# EAGLE schematic bc-module-sensor (EAGLE 7.7.0)
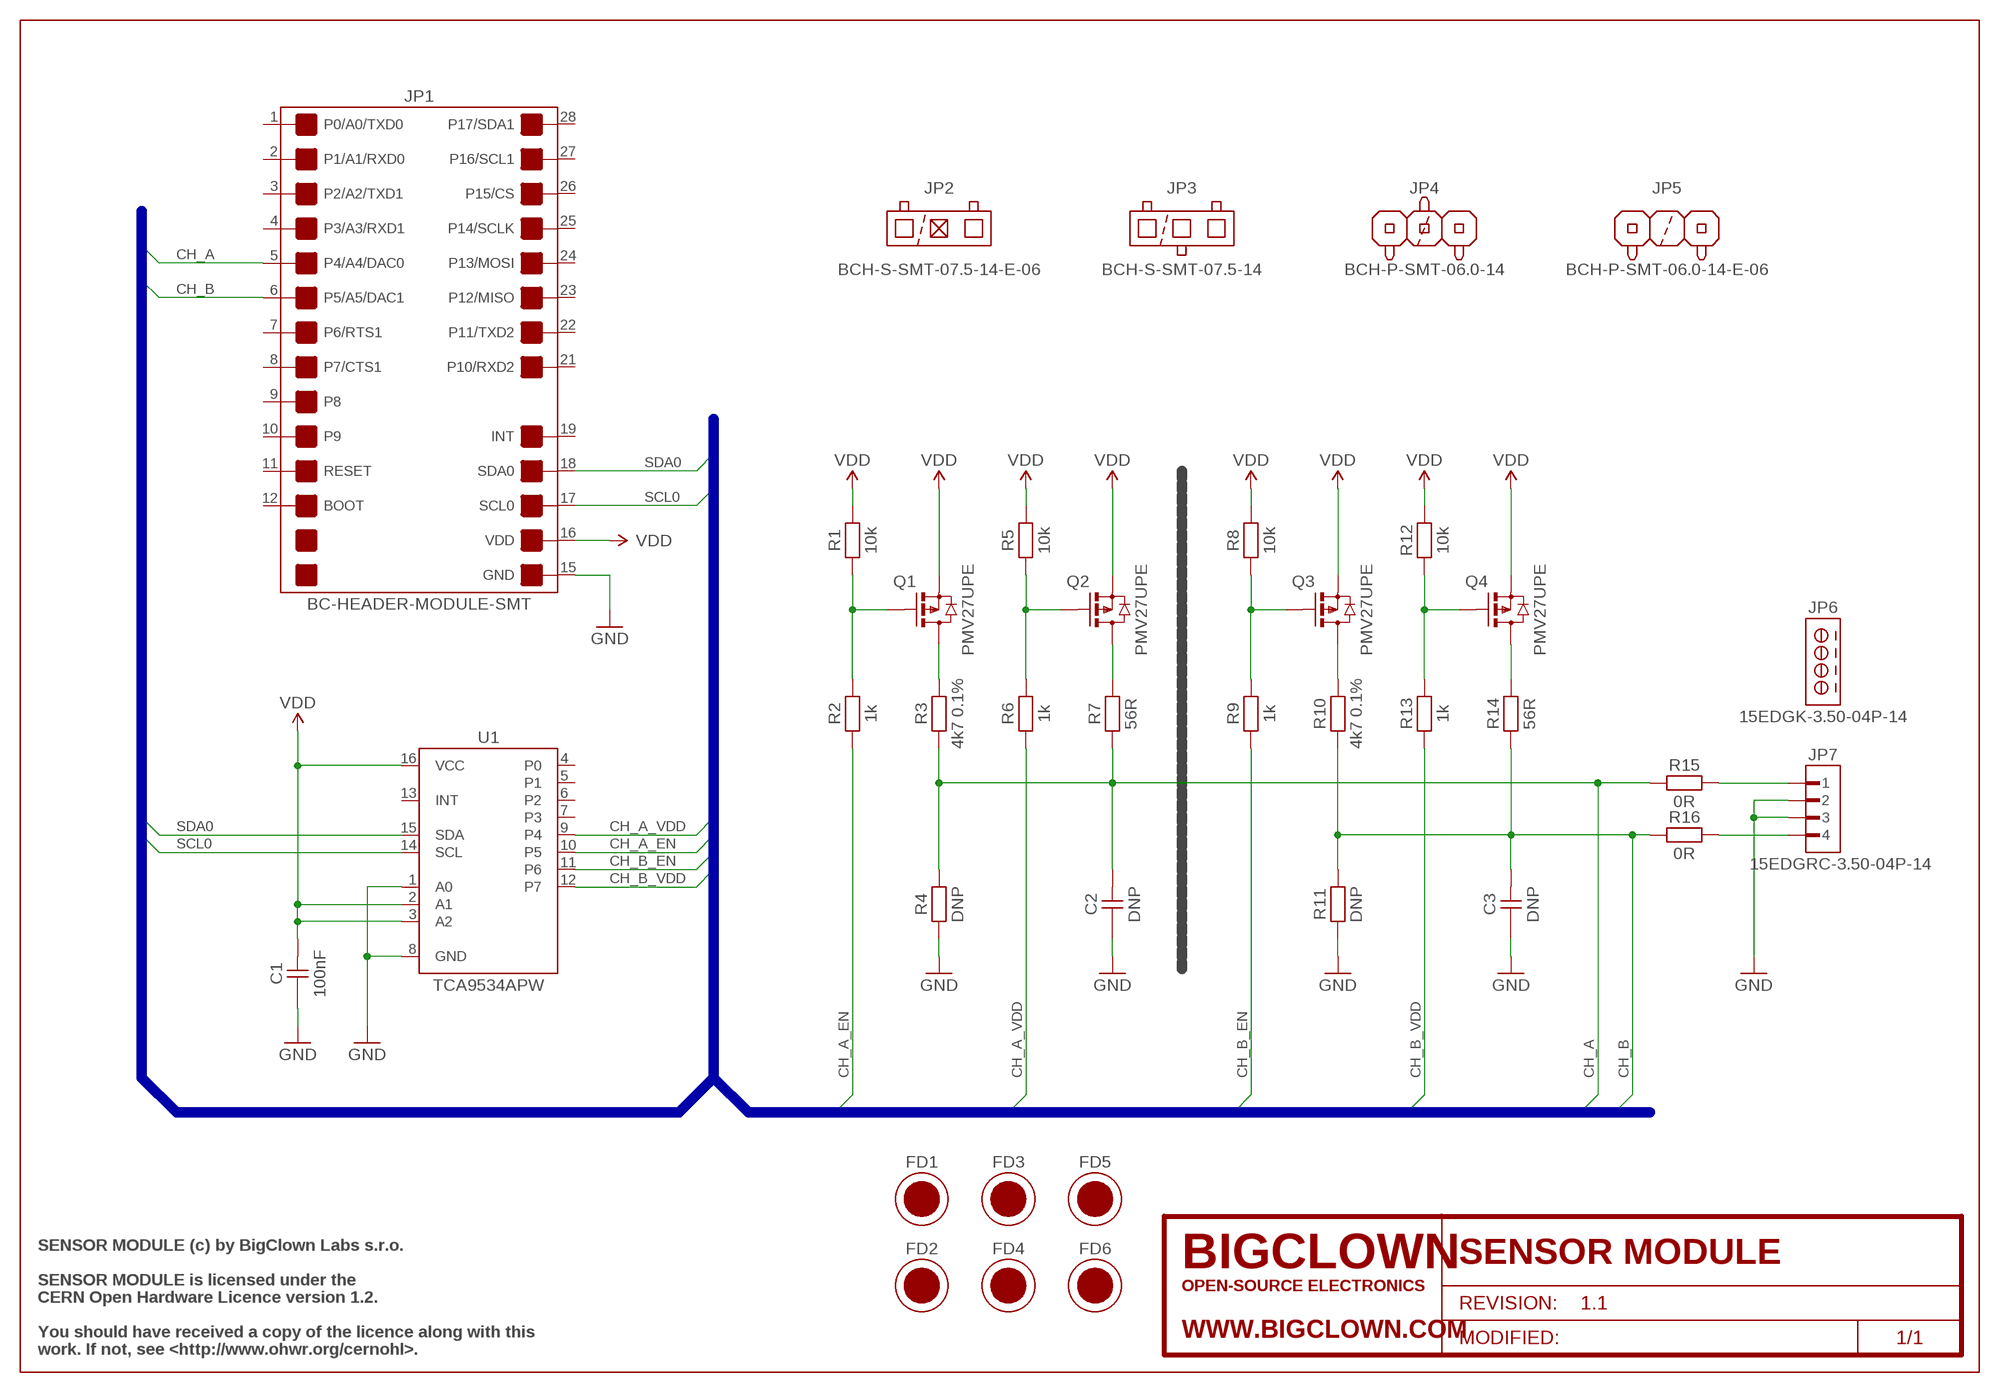
[diagram p0: schematic, sheet 1]
JP6 (JP-15EDGK-3.50-04P-14): BCPN: BC-JP-15EDGK-3.50-04P-14; VALUE: 15EDGK-3.50-04P-14

## Parts
C1  100nF  C-0603-100NF  [CAPACITOR-0603_R]
C2  DNP  C-0805-DNP  [CAPACITOR-0805_R]
C3  DNP  C-0805-DNP  [CAPACITOR-0805_R]
FD1  FIDUCIAL  [FIDUCIAL-1MM]
FD2  FIDUCIAL  [FIDUCIAL-1MM]
FD3  FIDUCIAL  [FIDUCIAL-1MM]
FD4  FIDUCIAL  [FIDUCIAL-1MM]
FD5  FIDUCIAL  [FIDUCIAL-1MM]
FD6  FIDUCIAL  [FIDUCIAL-1MM]
FRAME1  FRAME-SCH/A4L-BRD/A4L  [FRAME-A4L]
JP1  BC-HEADER-MODULE-SMT  [BC-HEADER-MODULE-SMT]
JP2  BCH-S-SMT-07.5-14-E-06  JP-BCH-S-SMT-07.5-14-E-06  [BCH-S-SMT-14-E-06]
JP3  BCH-S-SMT-07.5-14  JP-BCH-S-SMT-07.5-14  [BCH-S-SMT-14]
JP4  BCH-P-SMT-06.0-14  JP-BCH-P-SMT-06.0-14  [BCH-P-SMT-14]
JP5  BCH-P-SMT-06.0-14-E-06  JP-BCH-P-SMT-06.0-14-E-06  [BCH-P-SMT-14-E-06]
JP7  15EDGRC-3.50-04P-14  JP-15EDGRC-3.50-04P-14  [15EDGRC-3.50-04P-14_T]
Q1  PMV27UPE  Q-PMV27UPE  [SOT-23_R]
Q2  PMV27UPE  Q-PMV27UPE  [SOT-23_R]
Q3  PMV27UPE  Q-PMV27UPE  [SOT-23_R]
Q4  PMV27UPE  Q-PMV27UPE  [SOT-23_R]
R1  10k  R-0805-10K  [RESISTOR-0805_R]
R2  1k  R-0805-1K  [RESISTOR-0805_R]
R3  4k7 0.1%  R-0805-4K7  [RESISTOR-0805_R]
R4  DNP  R-0805-DNP  [RESISTOR-0805_R]
R5  10k  R-0805-10K  [RESISTOR-0805_R]
R6  1k  R-0805-1K  [RESISTOR-0805_R]
R7  56R  R-0805-56R  [RESISTOR-0805_R]
R8  10k  R-0805-10K  [RESISTOR-0805_R]
R9  1k  R-0805-1K  [RESISTOR-0805_R]
R10  4k7 0.1%  R-0805-4K7  [RESISTOR-0805_R]
R11  DNP  R-0805-DNP  [RESISTOR-0805_R]
R12  10k  R-0805-10K  [RESISTOR-0805_R]
R13  1k  R-0805-1K  [RESISTOR-0805_R]
R14  56R  R-0805-56R  [RESISTOR-0805_R]
R15  0R  R-0805-0R  [RESISTOR-0805_R]
R16  0R  R-0805-0R  [RESISTOR-0805_R]
U1  TCA9534APW  U-TCA9534APW  [TCA9534APW_R]

## Nets
A: JP7.1 R15.2
B: JP7.4 R16.2
CH_A: C2.1 JP1.5(P4/A4/DAC0) R3.1 R4.2 R7.1 R15.1
CH_A_EN: R2.1 U1.10(P5)
CH_A_EN_D: Q1.3(D) R3.2
CH_A_EN_G: Q1.1(G) R1.2 R2.2
CH_A_VDD: R6.1 U1.9(P4)
CH_A_VDD_D: Q2.3(D) R7.2
CH_A_VDD_G: Q2.1(G) R5.2 R6.2
CH_B: C3.1 JP1.6(P5/A5/DAC1) R10.1 R11.2 R14.1 R16.1
CH_B_EN: R9.1 U1.11(P6)
CH_B_EN_D: Q3.3(D) R10.2
CH_B_EN_G: Q3.1(G) R8.2 R9.2
CH_B_VDD: R13.1 U1.12(P7)
CH_B_VDD_D: Q4.3(D) R14.2
CH_B_VDD_G: Q4.1(G) R12.2 R13.2
GND: C1.2 C2.2 C3.2 JP1.15(GND) JP7.2 JP7.3 R4.1 R11.1 U1.1(A0) U1.8(GND)
SCL0: JP1.17(SCL0) U1.14(SCL)
SDA0: JP1.18(SDA0) U1.15(SDA)
VDD: C1.1 JP1.16(VDD) Q1.2(S) Q2.2(S) Q3.2(S) Q4.2(S) R1.1 R5.1 R8.1 R12.1 U1.2(A1) U1.3(A2) U1.16(VCC)
Unconnected: JP1.1(P0/A0/TXD0) JP1.2(P1/A1/RXD0) JP1.3(P2/A2/TXD1) JP1.4(P3/A3/RXD1) JP1.7(P6/RTS1) JP1.8(P7/CTS1) JP1.9(P8) JP1.10(P9) JP1.11(RESET) JP1.12(BOOT) JP1.19(INT) JP1.21(P10/RXD2) JP1.22(P11/TXD2) JP1.23(P12/MISO) JP1.24(P13/MOSI) JP1.25(P14/SCLK) JP1.26(P15/CS) JP1.27(P16/SCL1) JP1.28(P17/SDA1) U1.4(P0) U1.5(P1) U1.6(P2) U1.7(P3) U1.13(INT)

## Buses
SDA0,SCL0,CH_A,CH_A_EN,CH_A_VDD,CH_B,CH_B_EN,CH_B_VDD

## Notes on the sheet
- SENSOR MODULE (c) by BigClown Labs s.r.o.
- SENSOR MODULE is licensed under the
- CERN Open Hardware Licence version 1.2.
- You should have received a copy of the licence along with this
- work. If not, see <http://www.ohwr.org/cernohl>.

## Library data of the parts
C1 = bc-capacitor:C-0603-100NF; BCPN: BC-C-0603-100NF
C2 C3 = bc-capacitor:C-0805-DNP; BCPN: -
FD1-FD6 = bc-fiducial:FIDUCIAL; BCPN: -
FRAME1 = bc-frame:FRAME-SCH/A4L-BRD/A4L; BCPN: -; PROJECT_NAME: SENSOR MODULE; PROJECT_REVISION: 1.1
JP1 = bc-header:BC-HEADER-MODULE-SMT; BCPN: -
JP2 = bc-header:JP-BCH-S-SMT-07.5-14-E-06; BCPN: BC-JP-BCH-S-SMT-07.5-14-E-06
JP3 = bc-header:JP-BCH-S-SMT-07.5-14; BCPN: BC-JP-BCH-S-SMT-07.5-14
JP4 = bc-header:JP-BCH-P-SMT-06.0-14; BCPN: BC-JP-BCH-P-SMT-06.0-14
JP5 = bc-header:JP-BCH-P-SMT-06.0-14-E-06; BCPN: BC-JP-BCH-P-SMT-06.0-14-E-06
JP7 = bc-connector:JP-15EDGRC-3.50-04P-14; BCPN: BC-JP-15EDGRC-3.50-04P-14
Q1-Q4 = bc-discrete:Q-PMV27UPE; BCPN: BC-Q-PMV27UPE
R1 R5 R8 R12 = bc-resistor:R-0805-10K; BCPN: BC-R-0805-10K
R2 R6 R9 R13 = bc-resistor:R-0805-1K; BCPN: BC-R-0805-1K
R3 R10 = bc-resistor:R-0805-4K7; BCPN: BC-R-0805-4K7; VALUE: 4k7
R4 R11 = bc-resistor:R-0805-DNP; BCPN: -
R7 R14 = bc-resistor:R-0805-56R; BCPN: BC-R-0805-56R
R15 R16 = bc-resistor:R-0805-0R; BCPN: BC-R-0805-0R
U1 = bc-interface:U-TCA9534APW; BCPN: BC-U-TCA9534APW